# EAGLE design mini-store-selector (EAGLE 7.6.0)

## Sheet 1 of 4
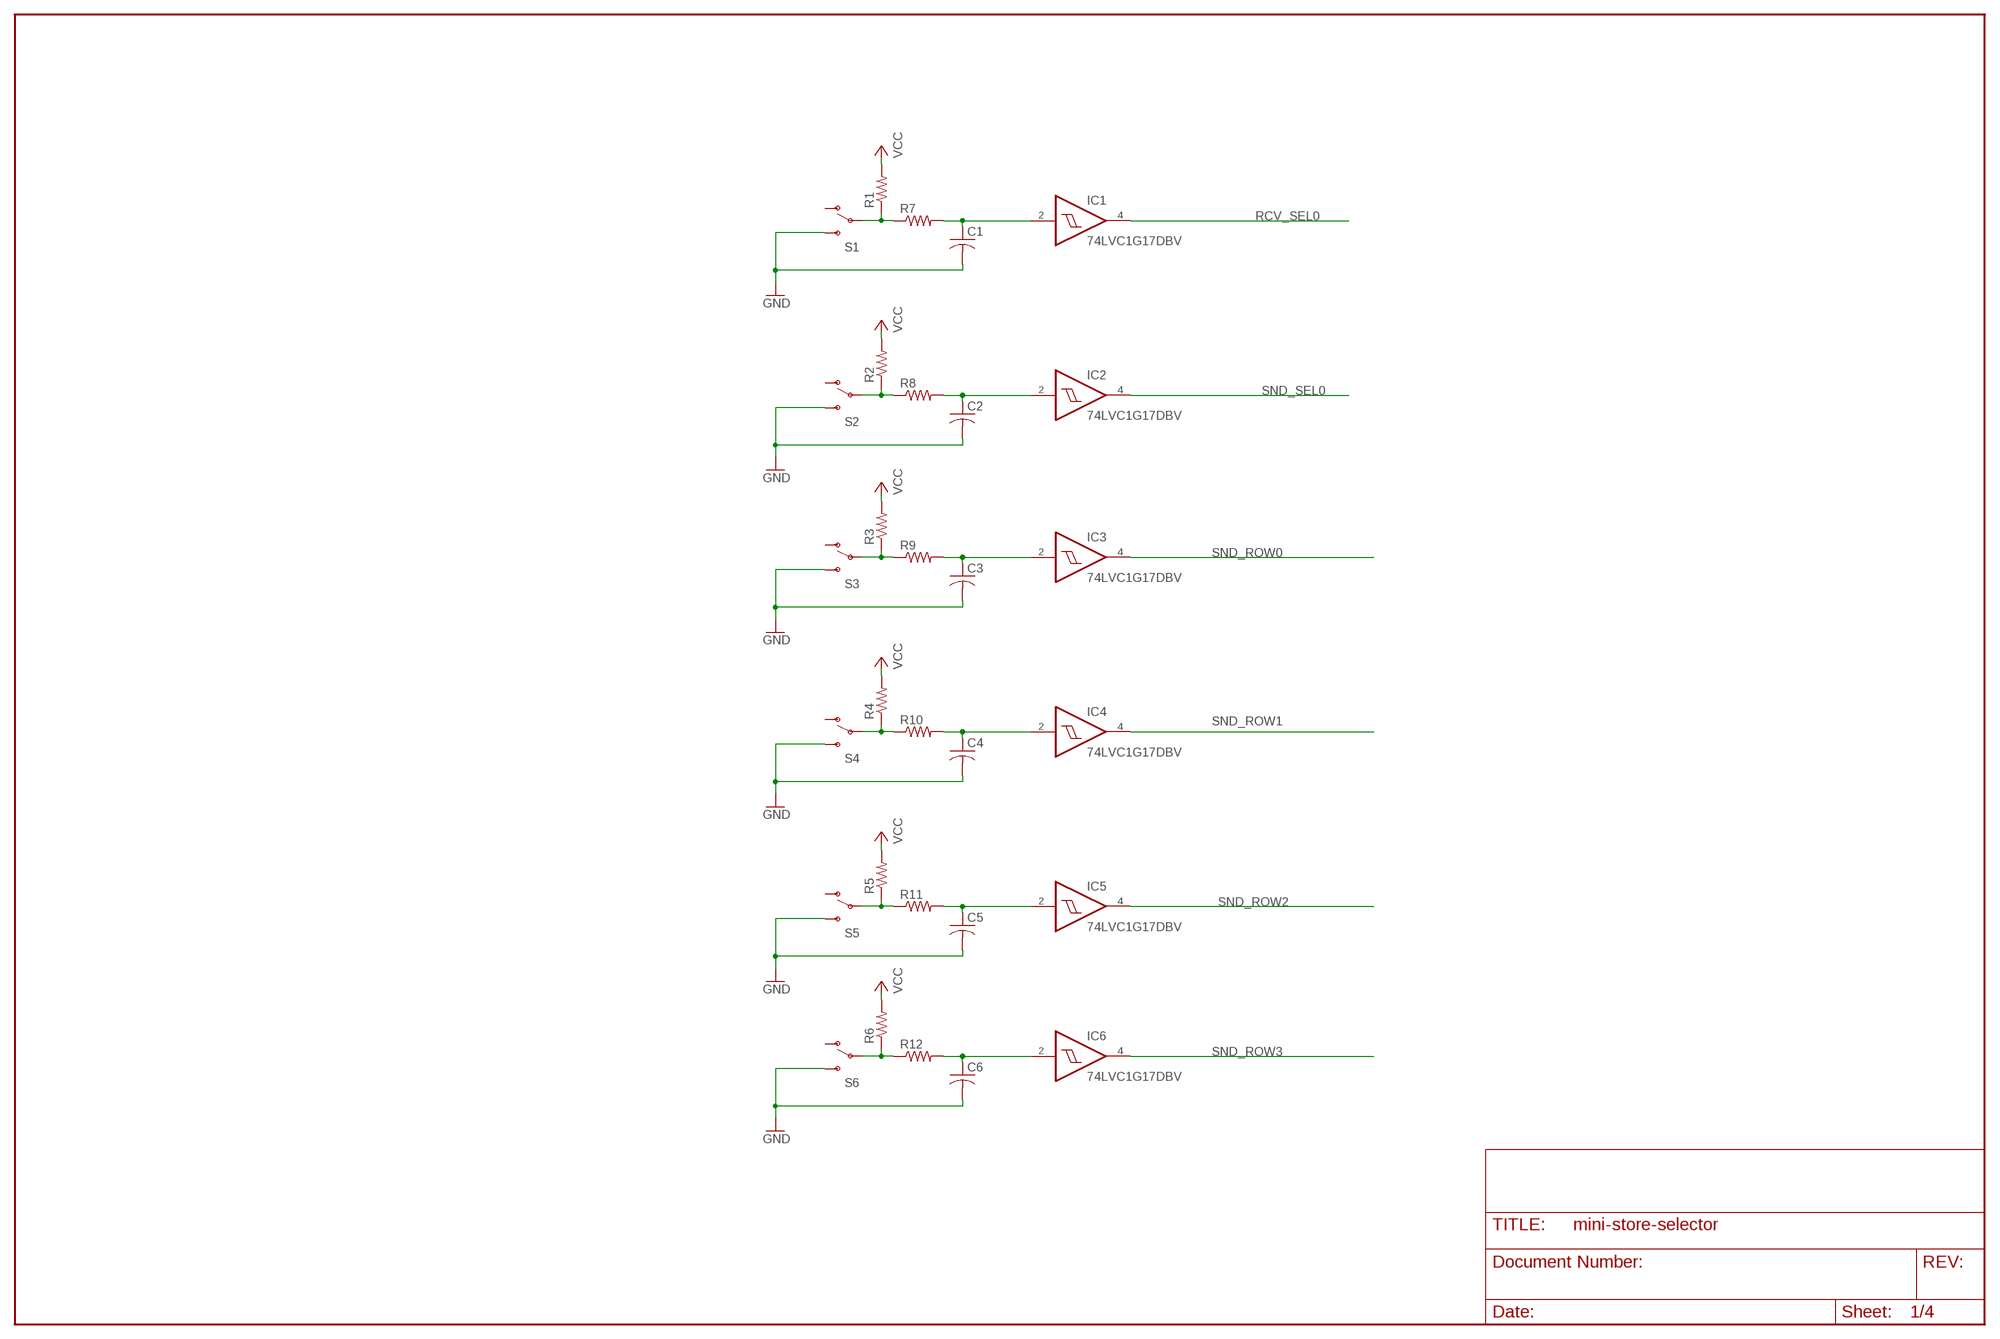
[diagram p0: schematic, sheet 1]

### Parts
C1  C-USC0805  [C0805]
C2  C-USC0805  [C0805]
C3  C-USC0805  [C0805]
C4  C-USC0805  [C0805]
C5  C-USC0805  [C0805]
C6  C-USC0805  [C0805]
IC1  74LVC1G17DBV  [SOT23-5]
IC2  74LVC1G17DBV  [SOT23-5]
IC3  74LVC1G17DBV  [SOT23-5]
IC4  74LVC1G17DBV  [SOT23-5]
IC5  74LVC1G17DBV  [SOT23-5]
IC6  74LVC1G17DBV  [SOT23-5]
R1  R-US_R0805  [R0805]
R2  R-US_R0805  [R0805]
R3  R-US_R0805  [R0805]
R4  R-US_R0805  [R0805]
R5  R-US_R0805  [R0805]
R6  R-US_R0805  [R0805]
R7  R-US_R0805  [R0805]
R8  R-US_R0805  [R0805]
R9  R-US_R0805  [R0805]
R10  R-US_R0805  [R0805]
R11  R-US_R0805  [R0805]
R12  R-US_R0805  [R0805]
S1  SWITCH-SPDTPTH  [SWITCH-SPDT]
S2  SWITCH-SPDTPTH  [SWITCH-SPDT]
S3  SWITCH-SPDTPTH  [SWITCH-SPDT]
S4  SWITCH-SPDTPTH  [SWITCH-SPDT]
S5  SWITCH-SPDTPTH  [SWITCH-SPDT]
S6  SWITCH-SPDTPTH  [SWITCH-SPDT]

### Nets
GND: C1.2 C2.2 C3.2 C4.2 C5.2 C6.2 S1.3(S) S2.3(S) S3.3(S) S4.3(S) S5.3(S) S6.3(S) ; also sheet 2,3,4
N$1: C6.1 IC6.2(I) R12.2
N$2: R6.1 R12.1 S6.2(P)
N$11: C2.1 IC2.2(I) R8.2
N$12: R2.1 R8.1 S2.2(P)
N$13: C1.1 IC1.2(I) R7.2
N$14: C4.1 IC4.2(I) R10.2
N$15: R4.1 R10.1 S4.2(P)
N$16: C3.1 IC3.2(I) R9.2
N$17: R3.1 R9.1 S3.2(P)
N$18: C5.1 IC5.2(I) R11.2
N$19: R5.1 R11.1 S5.2(P)
N$20: R1.1 R7.1 S1.2(P)
RCV_SEL0: IC1.4(O) ; also sheet 4
SND_ROW0: IC3.4(O) ; also sheet 4
SND_ROW1: IC4.4(O) ; also sheet 4
SND_ROW2: IC5.4(O) ; also sheet 4
SND_ROW3: IC6.4(O) ; also sheet 4
SND_SEL0: IC2.4(O) ; also sheet 4
VCC: R1.2 R2.2 R3.2 R4.2 R5.2 R6.2 ; also sheet 2,3,4
Unconnected: S1.1(O) S2.1(O) S3.1(O) S4.1(O) S5.1(O) S6.1(O)

## Sheet 2 of 4
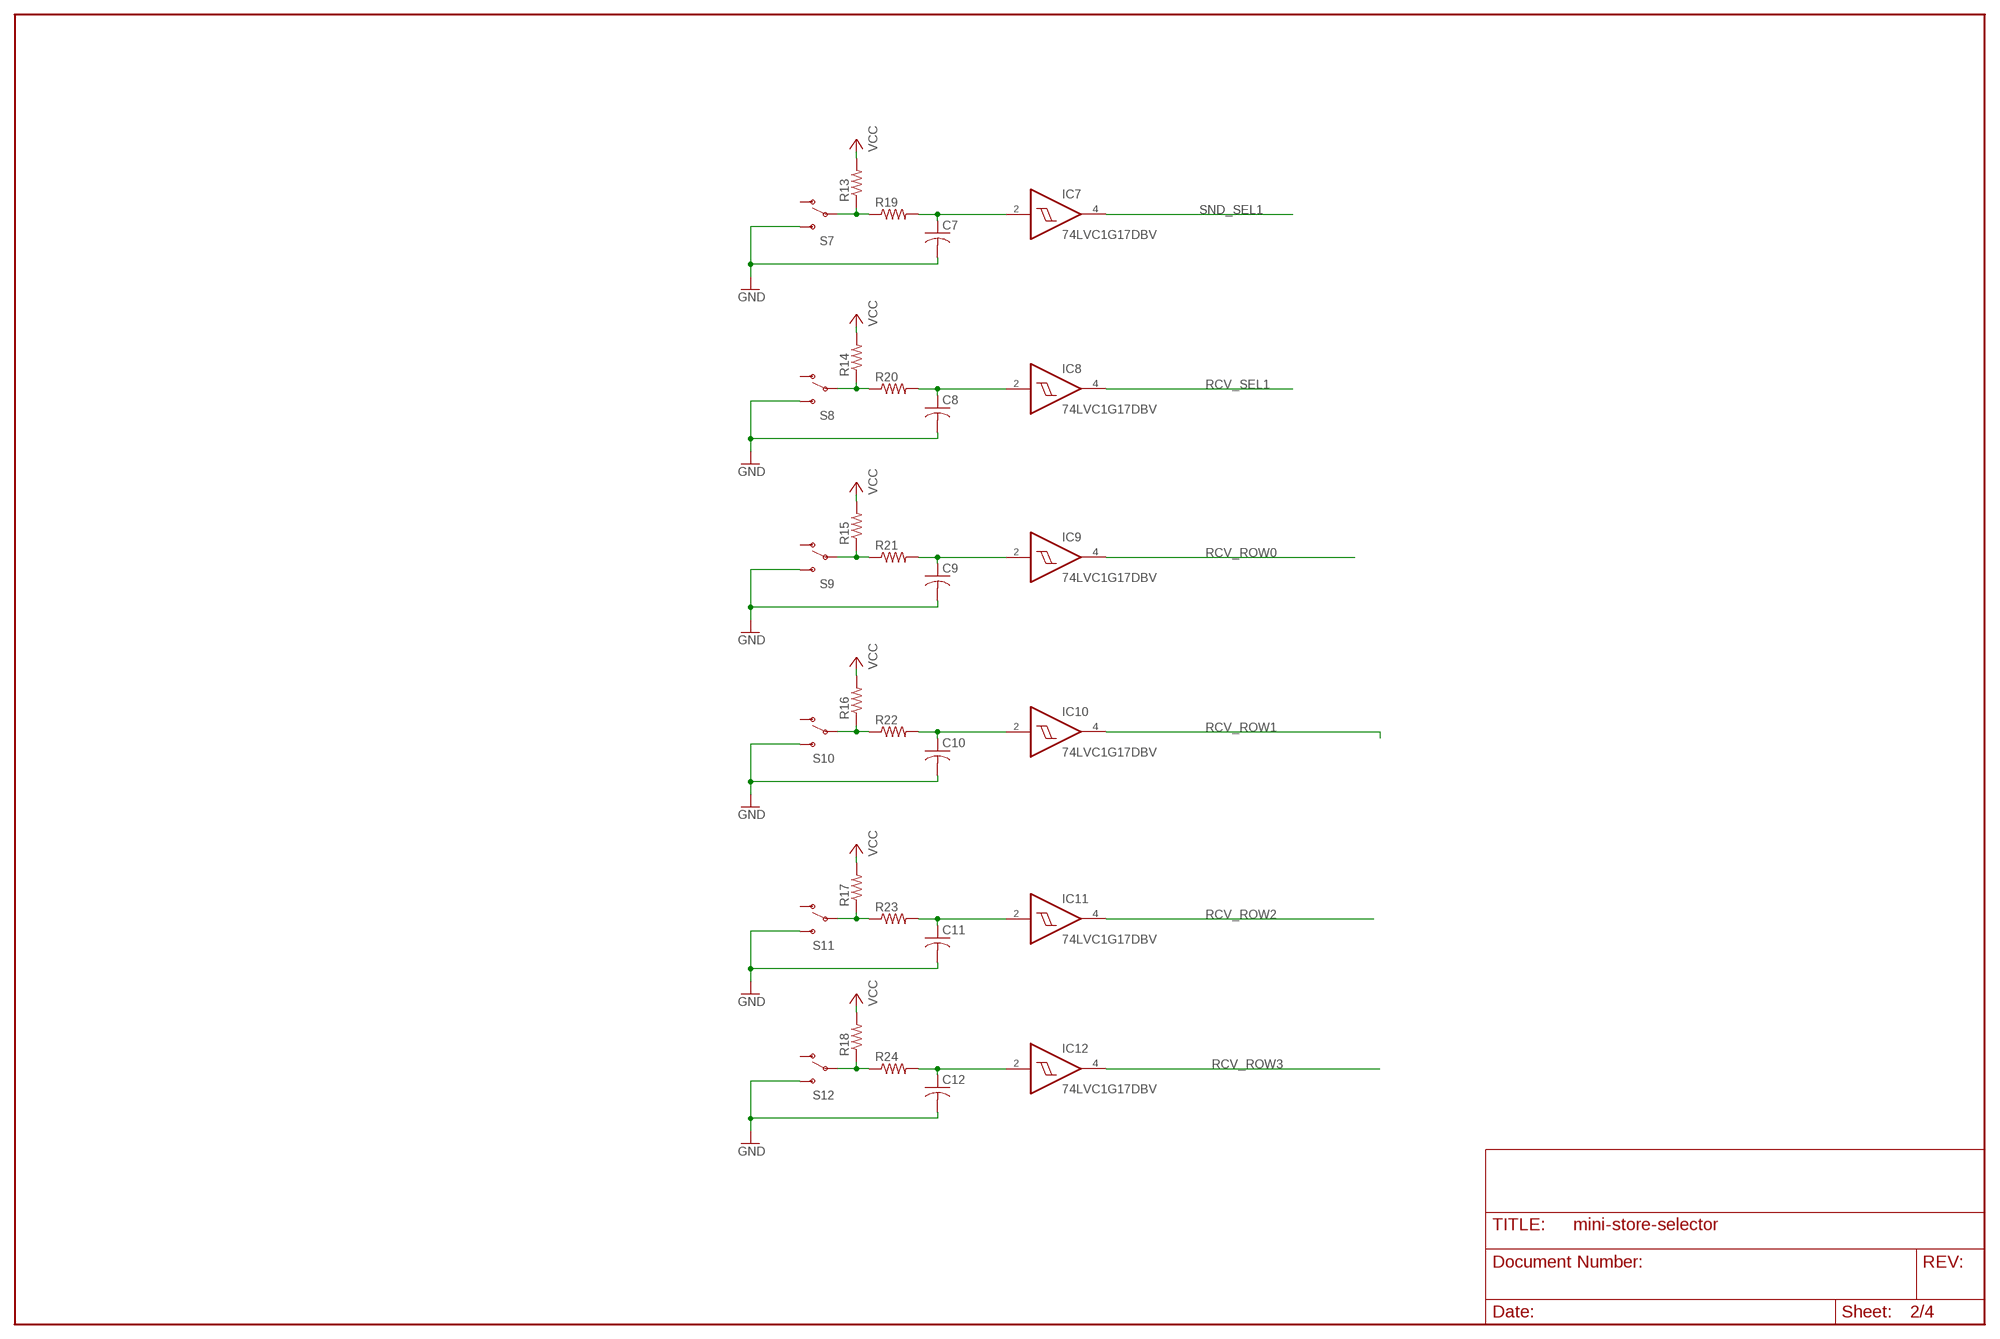
[diagram p1: schematic, sheet 2]

### Parts
C7  C-USC0805  [C0805]
C8  C-USC0805  [C0805]
C9  C-USC0805  [C0805]
C10  C-USC0805  [C0805]
C11  C-USC0805  [C0805]
C12  C-USC0805  [C0805]
IC7  74LVC1G17DBV  [SOT23-5]
IC8  74LVC1G17DBV  [SOT23-5]
IC9  74LVC1G17DBV  [SOT23-5]
IC10  74LVC1G17DBV  [SOT23-5]
IC11  74LVC1G17DBV  [SOT23-5]
IC12  74LVC1G17DBV  [SOT23-5]
R13  R-US_R0805  [R0805]
R14  R-US_R0805  [R0805]
R15  R-US_R0805  [R0805]
R16  R-US_R0805  [R0805]
R17  R-US_R0805  [R0805]
R18  R-US_R0805  [R0805]
R19  R-US_R0805  [R0805]
R20  R-US_R0805  [R0805]
R21  R-US_R0805  [R0805]
R22  R-US_R0805  [R0805]
R23  R-US_R0805  [R0805]
R24  R-US_R0805  [R0805]
S7  SWITCH-SPDTPTH  [SWITCH-SPDT]
S8  SWITCH-SPDTPTH  [SWITCH-SPDT]
S9  SWITCH-SPDTPTH  [SWITCH-SPDT]
S10  SWITCH-SPDTPTH  [SWITCH-SPDT]
S11  SWITCH-SPDTPTH  [SWITCH-SPDT]
S12  SWITCH-SPDTPTH  [SWITCH-SPDT]

### Nets
GND: C7.2 C8.2 C9.2 C10.2 C11.2 C12.2 S7.3(S) S8.3(S) S9.3(S) S10.3(S) S11.3(S) S12.3(S) ; also sheet 1,3,4
N$3: C10.1 IC10.2(I) R22.2
N$4: R16.1 R22.1 S10.2(P)
N$5: C9.1 IC9.2(I) R21.2
N$6: R15.1 R21.1 S9.2(P)
N$7: C11.1 IC11.2(I) R23.2
N$8: R17.1 R23.1 S11.2(P)
N$9: C12.1 IC12.2(I) R24.2
N$10: R18.1 R24.1 S12.2(P)
N$25: C8.1 IC8.2(I) R20.2
N$26: R14.1 R20.1 S8.2(P)
N$27: C7.1 IC7.2(I) R19.2
N$28: R13.1 R19.1 S7.2(P)
RCV_ROW0: IC9.4(O) ; also sheet 4
RCV_ROW1: IC10.4(O) ; also sheet 4
RCV_ROW2: IC11.4(O) ; also sheet 4
RCV_ROW3: IC12.4(O) ; also sheet 4
RCV_SEL1: IC8.4(O) ; also sheet 4
SND_SEL1: IC7.4(O) ; also sheet 4
VCC: R13.2 R14.2 R15.2 R16.2 R17.2 R18.2 ; also sheet 1,3,4
Unconnected: S7.1(O) S8.1(O) S9.1(O) S10.1(O) S11.1(O) S12.1(O)

## Sheet 3 of 4
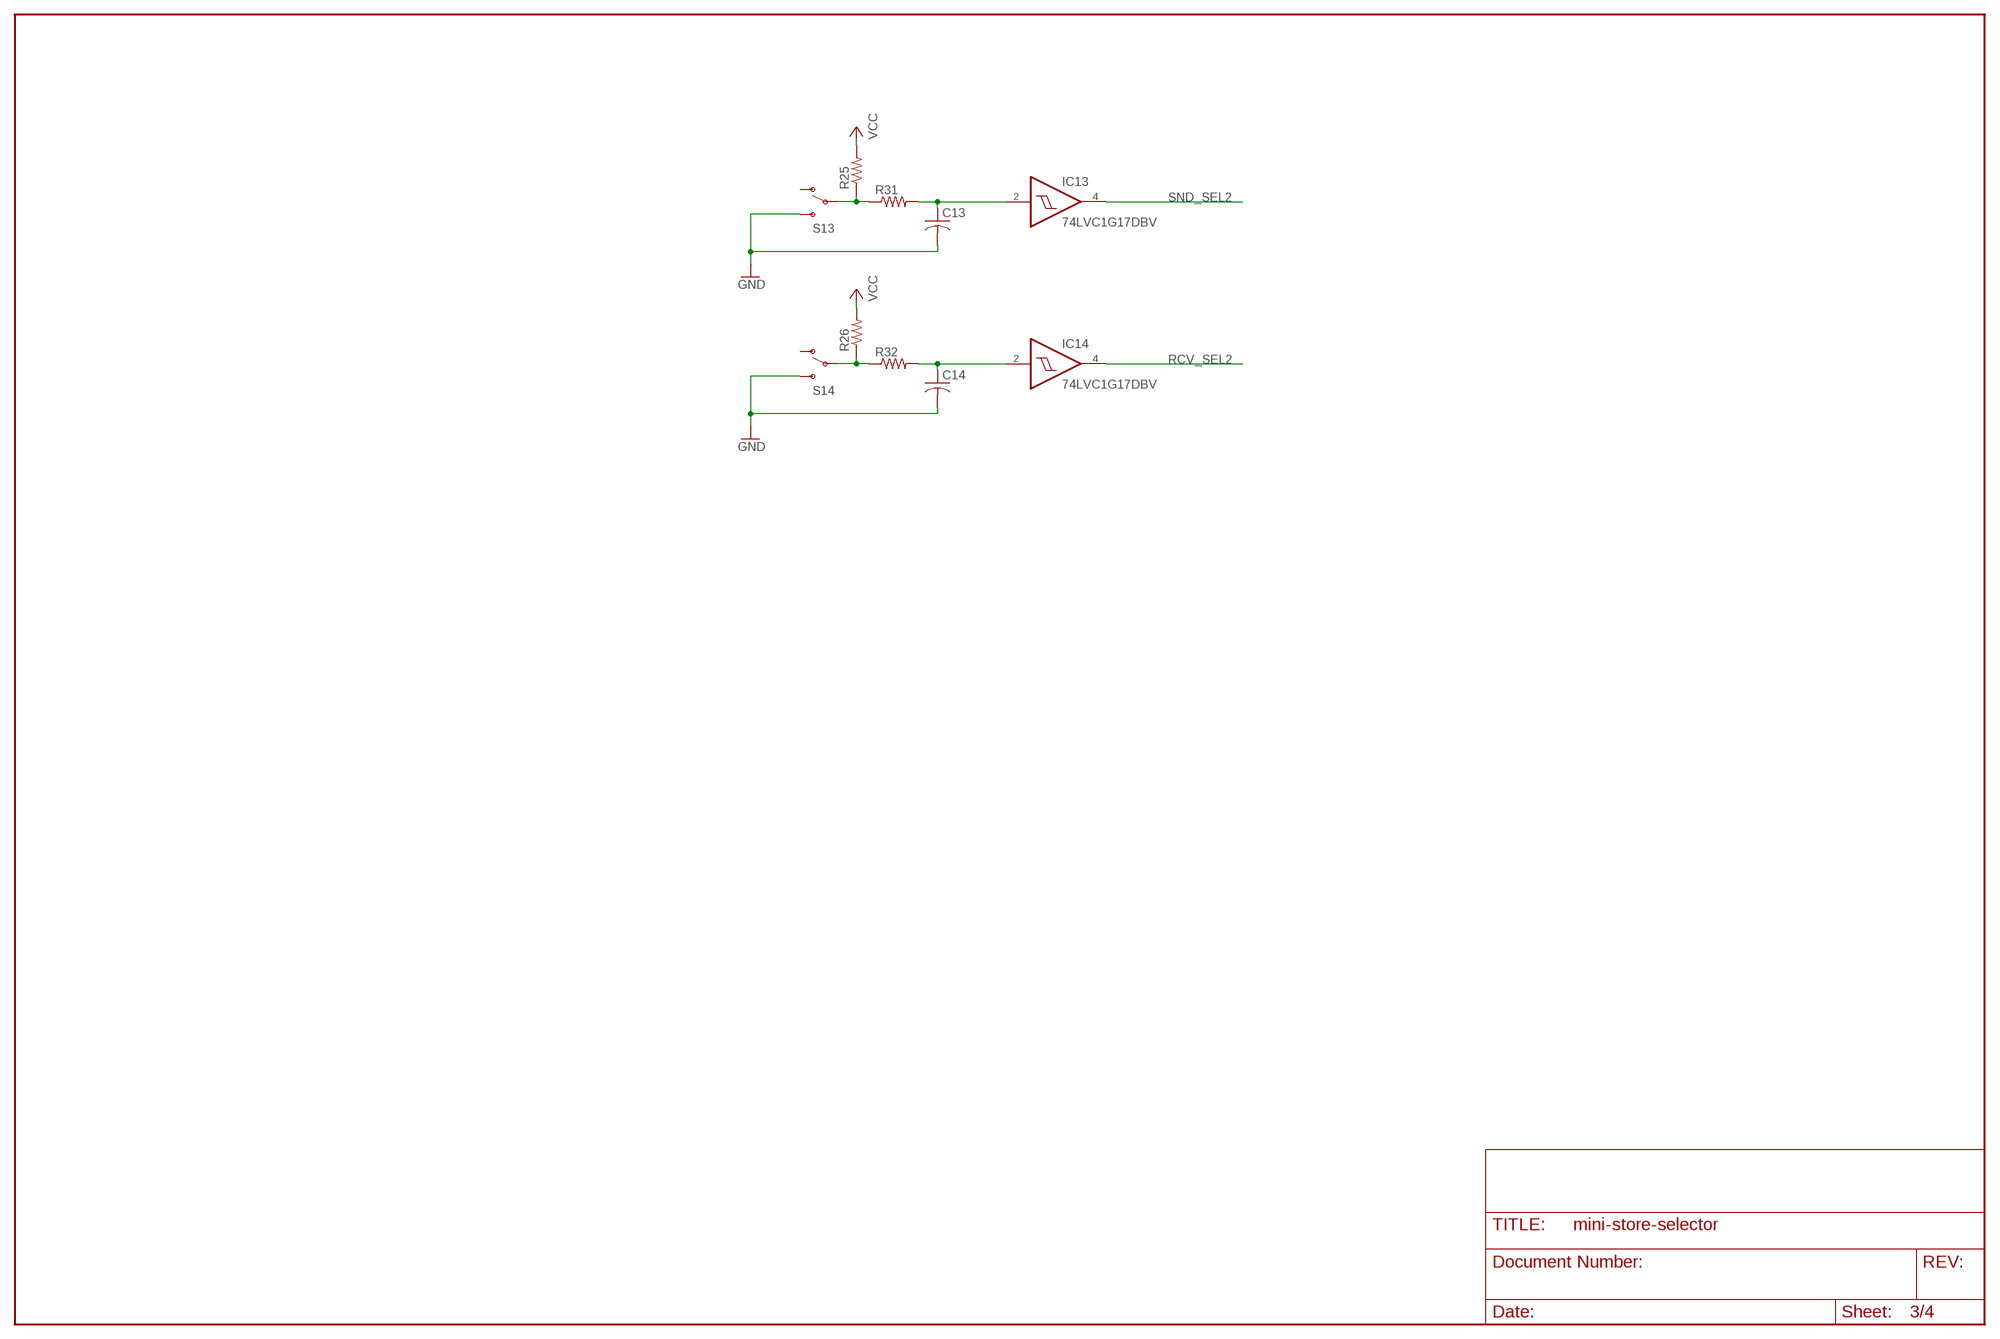
[diagram p2: schematic, sheet 3]

### Parts
C13  C-USC0805  [C0805]
C14  C-USC0805  [C0805]
IC13  74LVC1G17DBV  [SOT23-5]
IC14  74LVC1G17DBV  [SOT23-5]
R25  R-US_R0805  [R0805]
R26  R-US_R0805  [R0805]
R31  R-US_R0805  [R0805]
R32  R-US_R0805  [R0805]
S13  SWITCH-SPDTPTH  [SWITCH-SPDT]
S14  SWITCH-SPDTPTH  [SWITCH-SPDT]

### Nets
GND: C13.2 C14.2 S13.3(S) S14.3(S) ; also sheet 1,2,4
N$51: C14.1 IC14.2(I) R32.2
N$52: R26.1 R32.1 S14.2(P)
N$53: C13.1 IC13.2(I) R31.2
N$54: R25.1 R31.1 S13.2(P)
RCV_SEL2: IC14.4(O) ; also sheet 4
SND_SEL2: IC13.4(O) ; also sheet 4
VCC: R25.2 R26.2 ; also sheet 1,2,4
Unconnected: S13.1(O) S14.1(O)

## Sheet 4 of 4
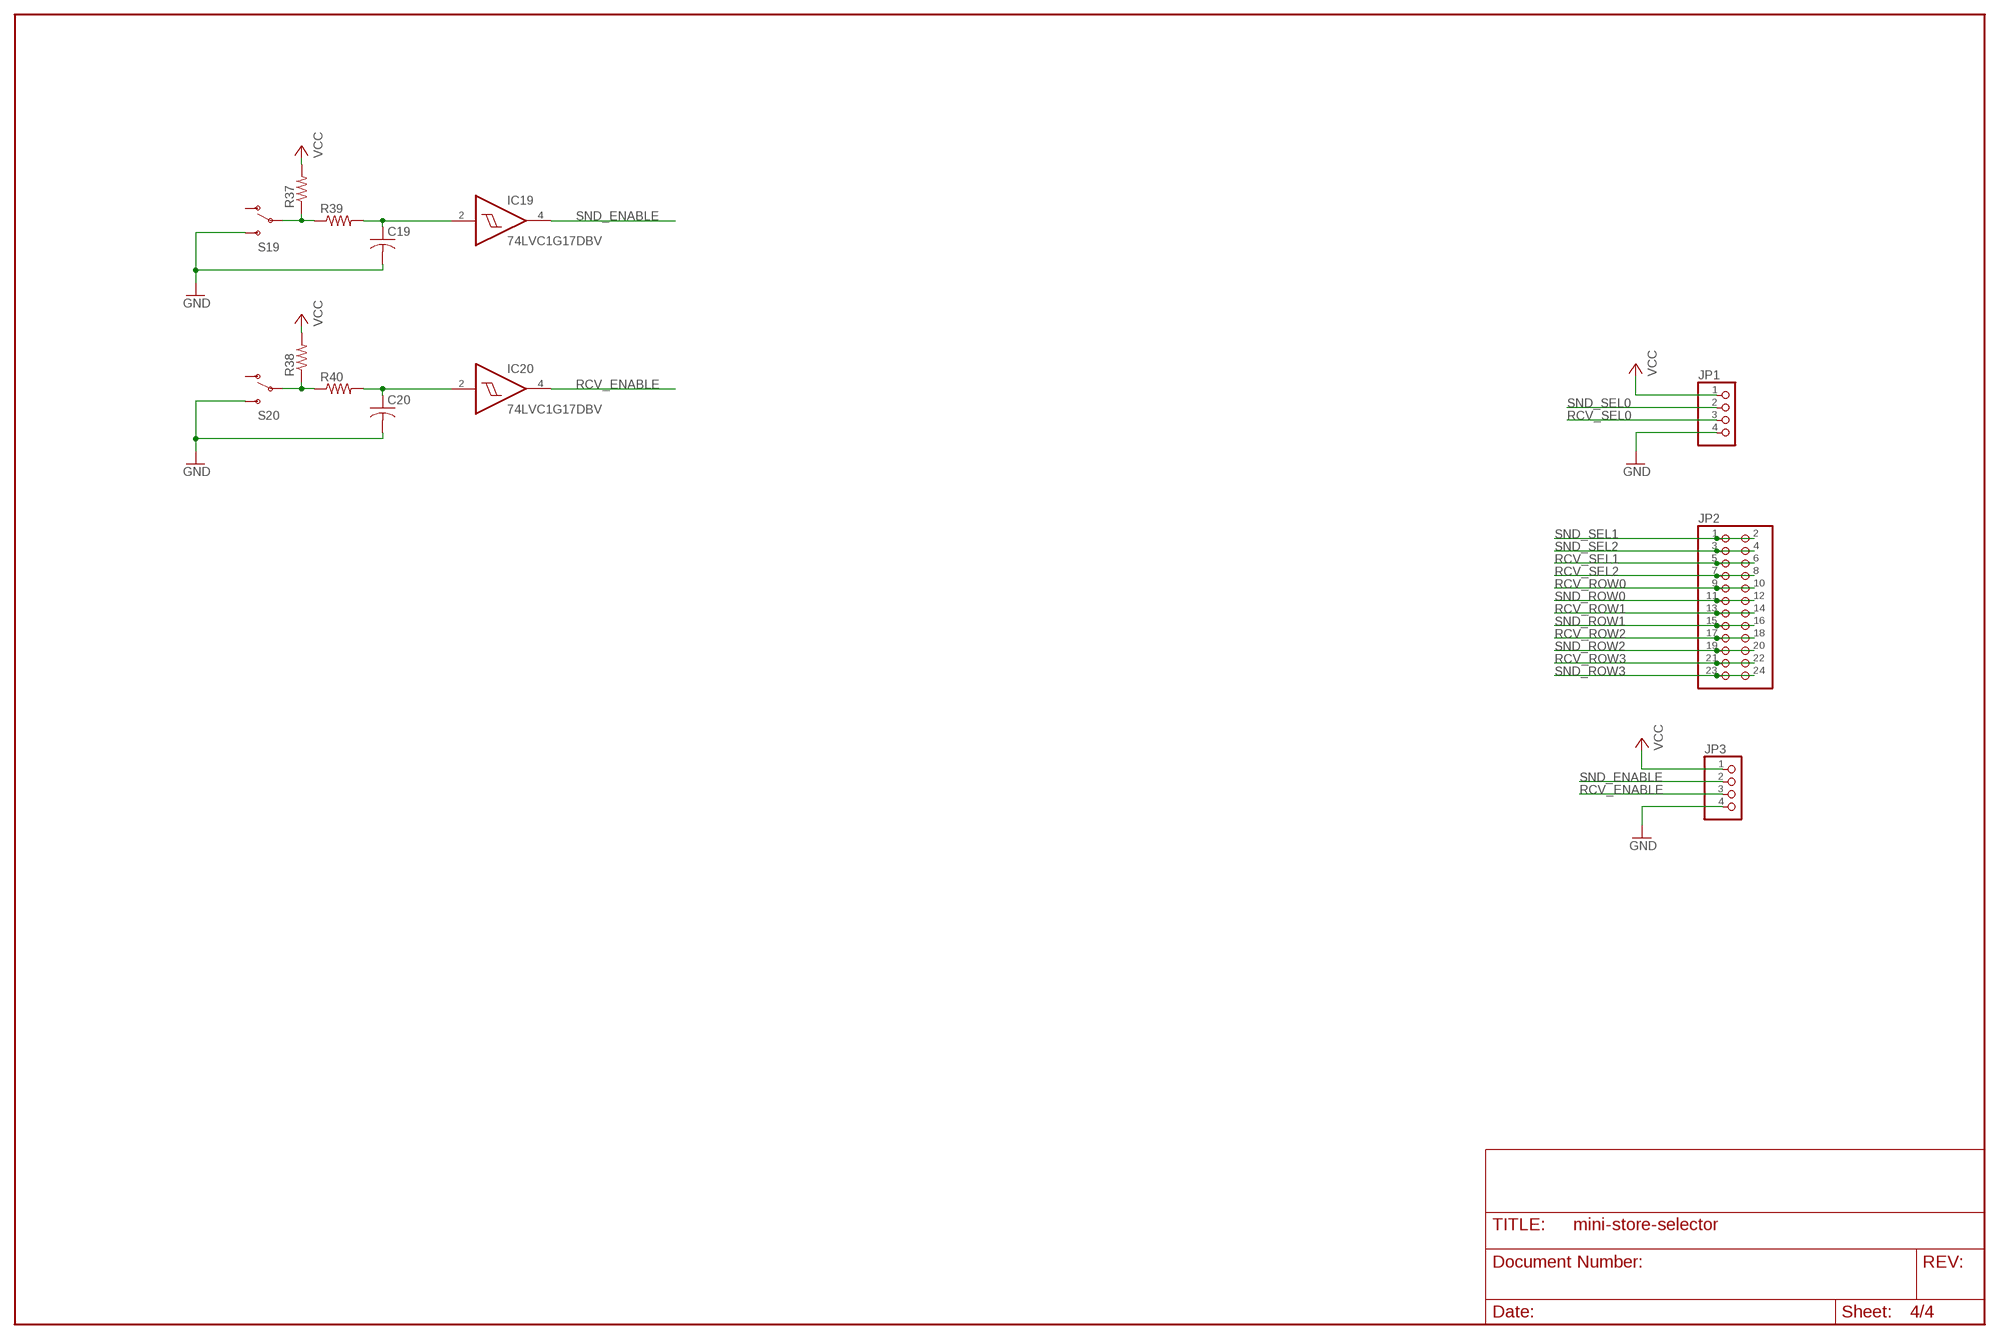
[diagram p3: schematic, sheet 4]

### Parts
C19  C-USC0805  [C0805]
C20  C-USC0805  [C0805]
IC19  74LVC1G17DBV  [SOT23-5]
IC20  74LVC1G17DBV  [SOT23-5]
JP1  PINHD-1X4  [1X04]
JP2  PINHD-2X12  [2X12]
JP3  PINHD-1X4  [1X04]
R37  R-US_R0805  [R0805]
R38  R-US_R0805  [R0805]
R39  R-US_R0805  [R0805]
R40  R-US_R0805  [R0805]
S19  SWITCH-SPDTPTH  [SWITCH-SPDT]
S20  SWITCH-SPDTPTH  [SWITCH-SPDT]

### Nets
GND: C19.2 C20.2 JP1.4 JP3.4 S19.3(S) S20.3(S) ; also sheet 1,2,3
N$21: C20.1 IC20.2(I) R40.2
N$22: R38.1 R40.1 S20.2(P)
N$29: C19.1 IC19.2(I) R39.2
N$30: R37.1 R39.1 S19.2(P)
RCV_ENABLE: IC20.4(O) JP3.3
RCV_ROW0: JP2.9 JP2.10 ; also sheet 2
RCV_ROW1: JP2.13 JP2.14 ; also sheet 2
RCV_ROW2: JP2.17 JP2.18 ; also sheet 2
RCV_ROW3: JP2.21 JP2.22 ; also sheet 2
RCV_SEL0: JP1.3 ; also sheet 1
RCV_SEL1: JP2.5 JP2.6 ; also sheet 2
RCV_SEL2: JP2.7 JP2.8 ; also sheet 3
SND_ENABLE: IC19.4(O) JP3.2
SND_ROW0: JP2.11 JP2.12 ; also sheet 1
SND_ROW1: JP2.15 JP2.16 ; also sheet 1
SND_ROW2: JP2.19 JP2.20 ; also sheet 1
SND_ROW3: JP2.23 JP2.24 ; also sheet 1
SND_SEL0: JP1.2 ; also sheet 1
SND_SEL1: JP2.1 JP2.2 ; also sheet 2
SND_SEL2: JP2.3 JP2.4 ; also sheet 3
VCC: JP1.1 JP3.1 R37.2 R38.2 ; also sheet 1,2,3
Unconnected: S19.1(O) S20.1(O)

## Power pins joined to a net without a drawn wire
GND: IC1.3(GND) IC2.3(GND) IC3.3(GND) IC4.3(GND) IC5.3(GND) IC6.3(GND) IC7.3(GND) IC8.3(GND) IC9.3(GND) IC10.3(GND) IC11.3(GND) IC12.3(GND) IC13.3(GND) IC14.3(GND) IC19.3(GND) IC20.3(GND)
VCC: IC1.5(VCC) IC2.5(VCC) IC3.5(VCC) IC4.5(VCC) IC5.5(VCC) IC6.5(VCC) IC7.5(VCC) IC8.5(VCC) IC9.5(VCC) IC10.5(VCC) IC11.5(VCC) IC12.5(VCC) IC13.5(VCC) IC14.5(VCC) IC19.5(VCC) IC20.5(VCC)

## Library data of the parts
C1-C14 C19 C20 = resistor:C-US: CAPACITOR, American symbol
IC1-IC14 IC19 IC20 = 74xx-little-us:74*1G17: Single Schmitt-Trigger Buffer
JP1 JP3 = pinhead:PINHD-1X4: PIN HEADER
JP2 = pinhead:PINHD-2X12: PIN HEADER
R1-R26 R31 R32 R37-R40 = resistor:R-US_: RESISTOR, American symbol
S1-S14 S19 S20 = SparkFun-Electromechanical:SWITCH-SPDT: SPDT Switch Simple slide switch, Spark Fun Electronics SKU : COM-00102 DPDT SMT slide switch, AYZ0202, SWCH-08179

## Board
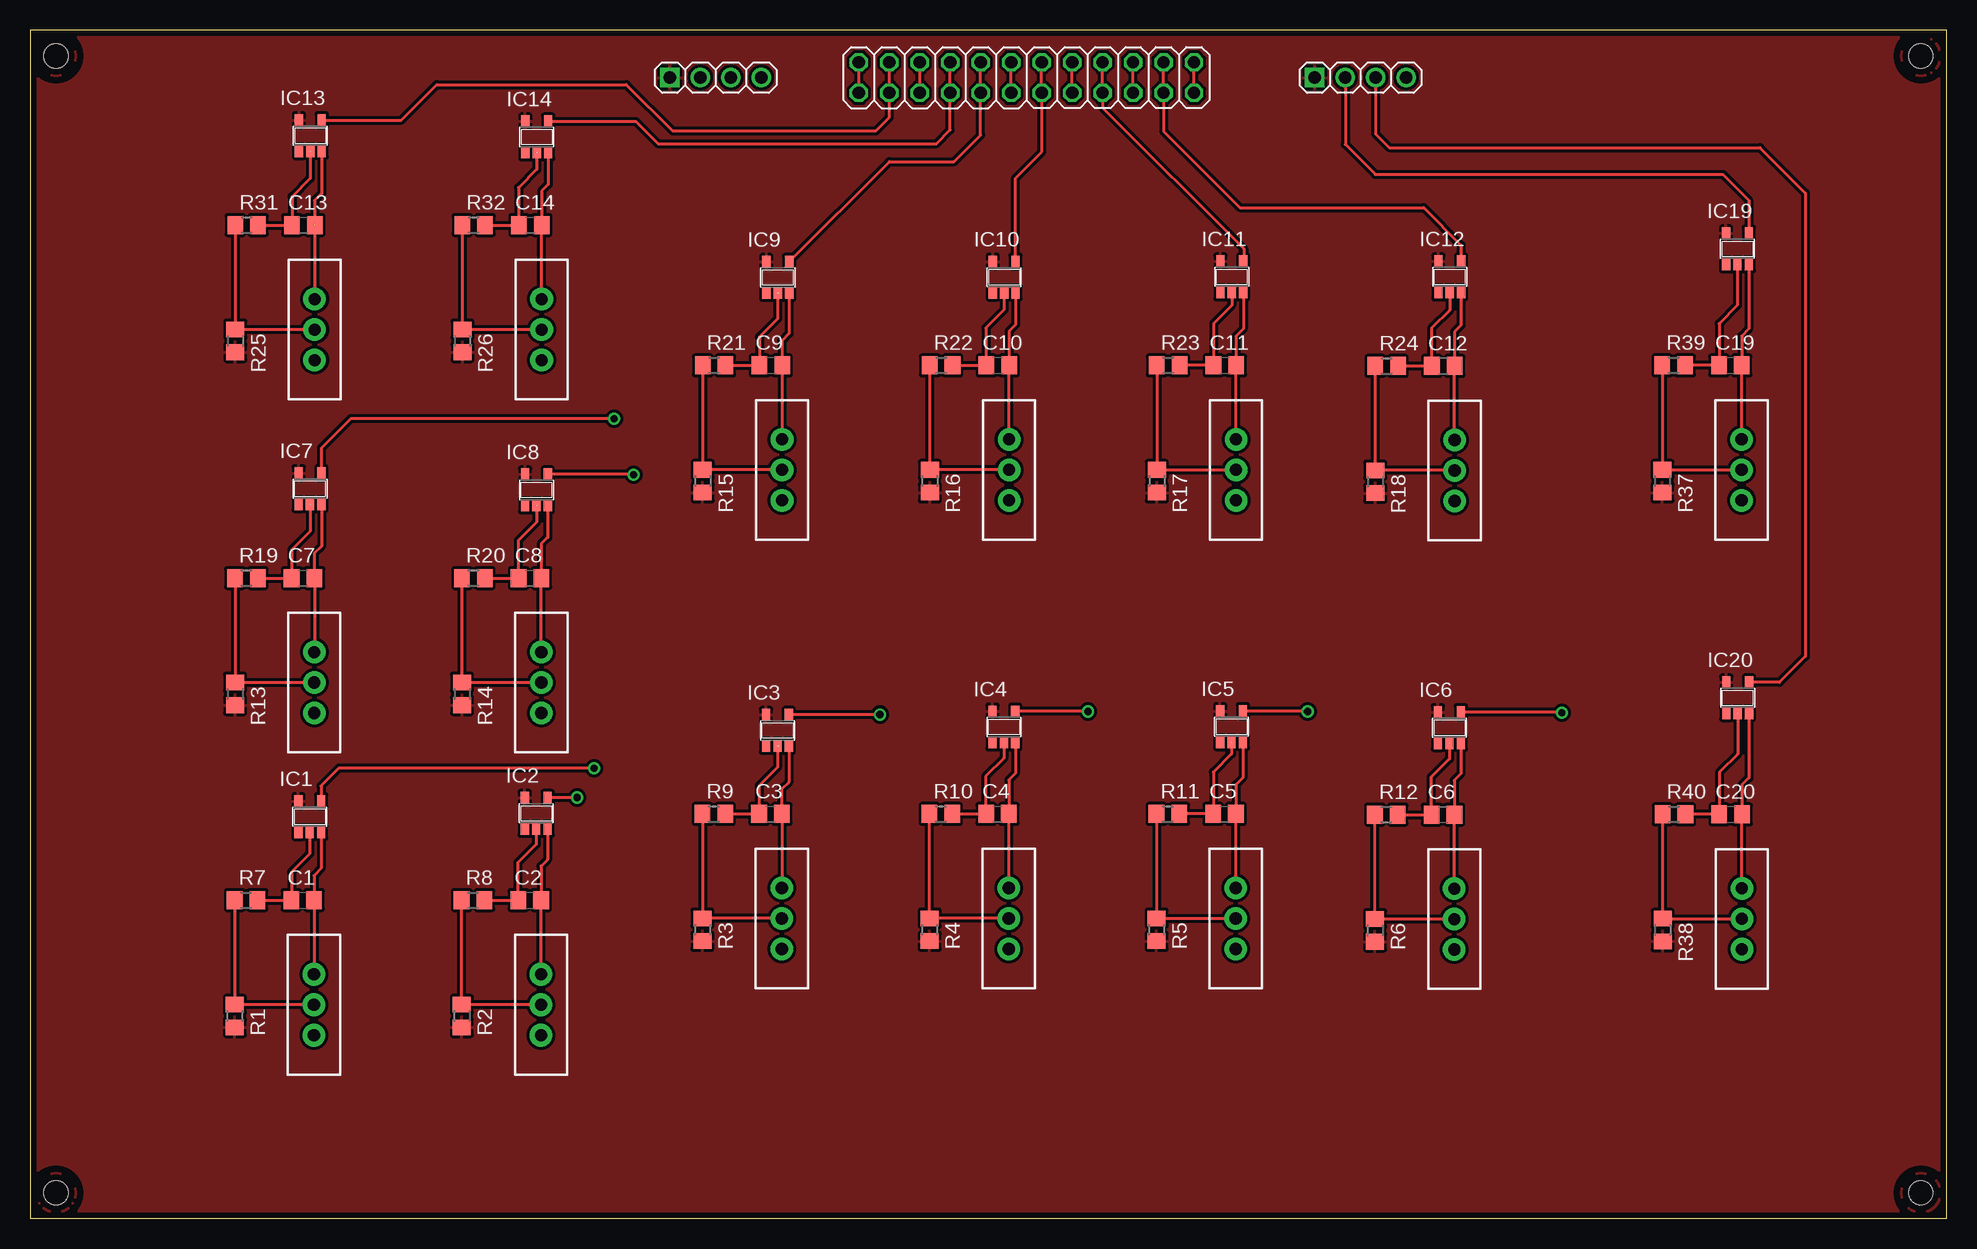
[diagram p4: board, top side]
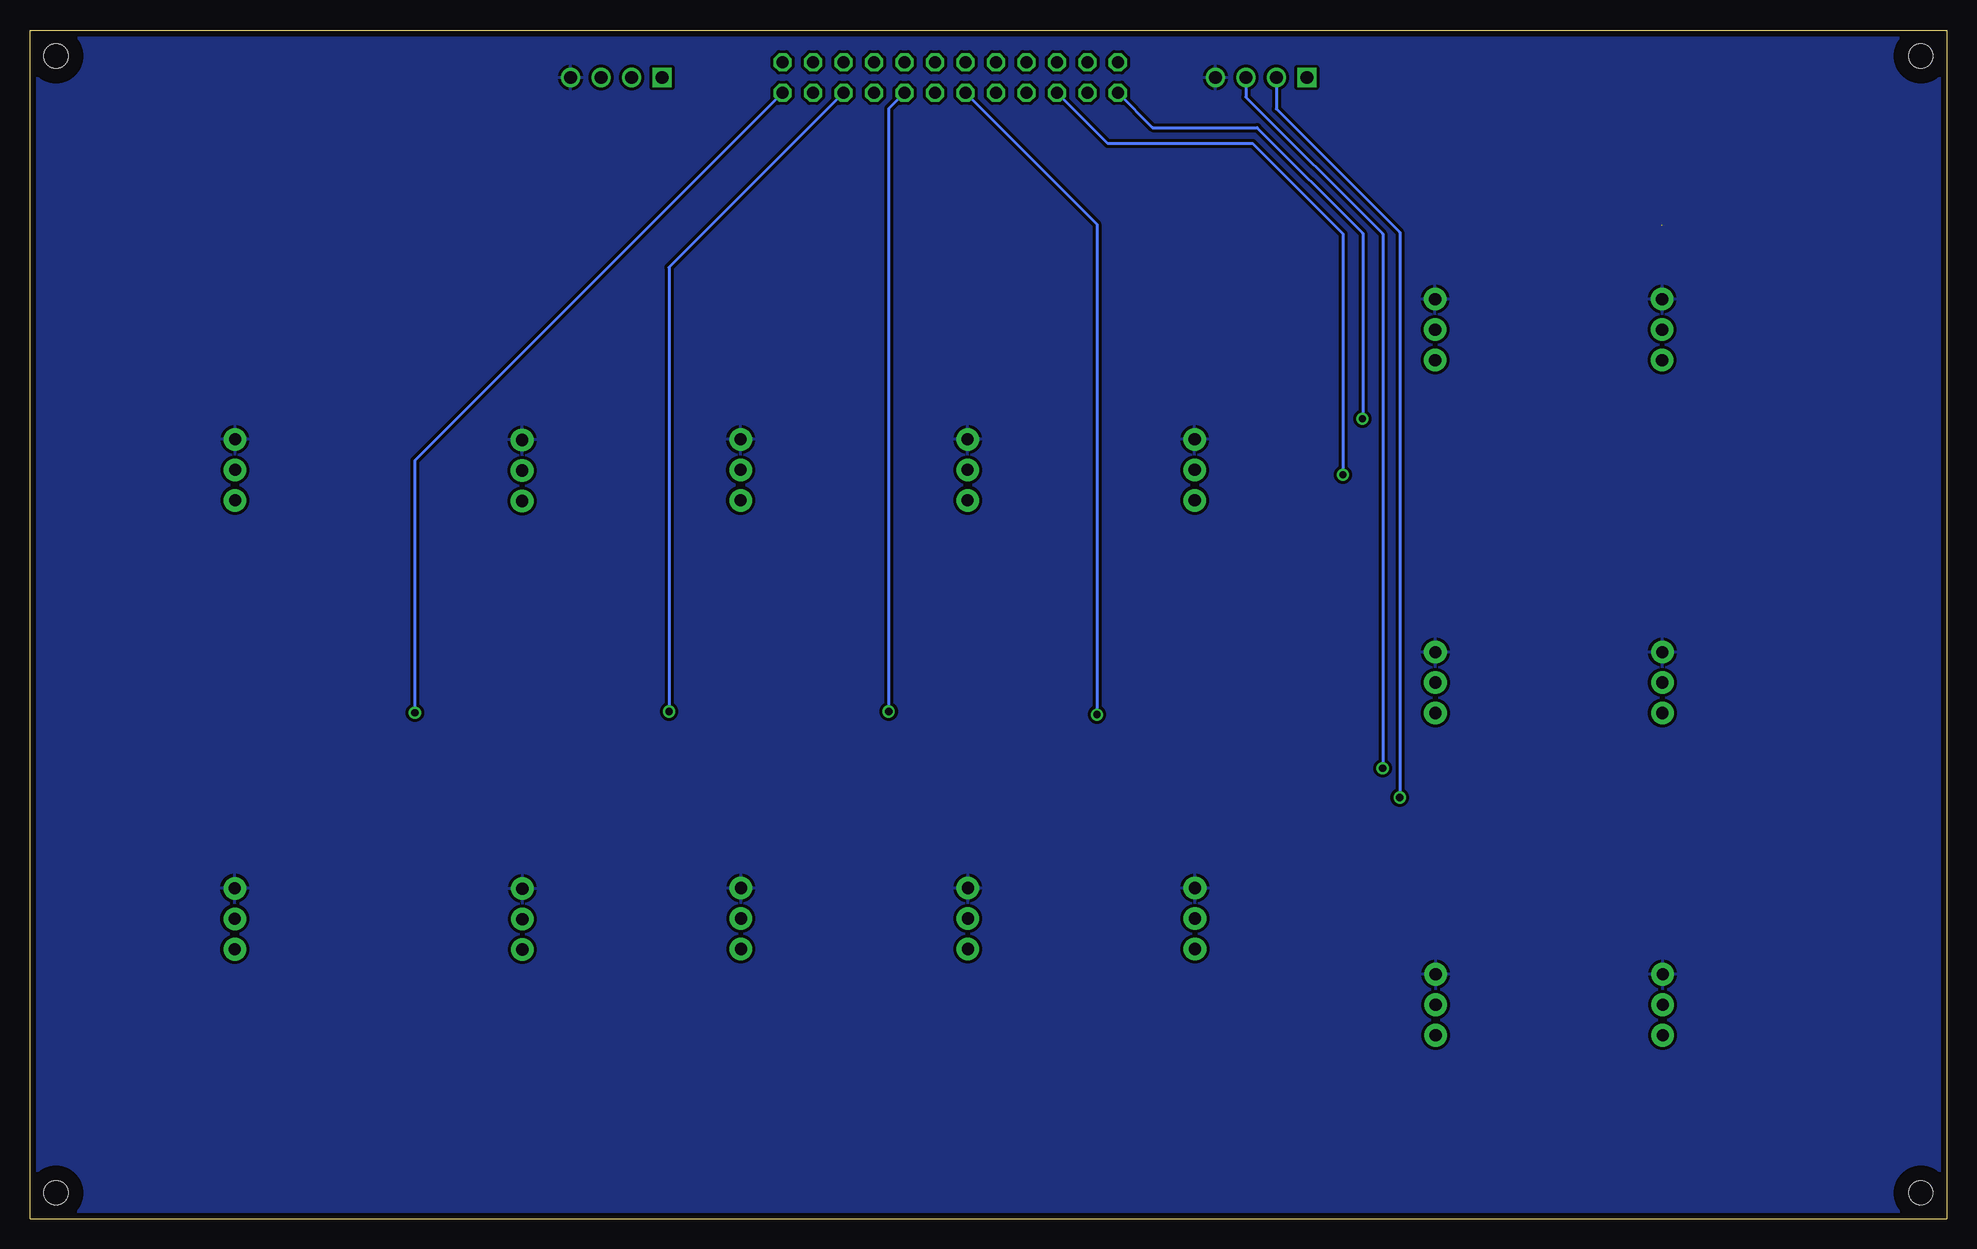
[diagram p5: board, bottom side, seen from below]

Size 159.77 x 99.06 mm. Coordinates in mm from the lower left corner, seen from the top.
Outline: 159.77,99.06 0,99.06 0,0 159.77,0 159.77,99.06
Copper layers (1*16): Top 0.035mm / dielectric 1.5mm / Bottom 0.035mm
Design rules "default *": minimum track width 8mil, minimum drill 12mil, track to track 8mil, track to pad 10mil, pad to pad 10mil, via to via 8mil, smd to smd 8mil, copper to edge 20mil, drill to drill 8mil, minimum pad ring 10mil, minimum via ring 8mil, stop-mask expansion 4mil, vias tented up to drill 0mil, thermal gap 10mil
Holes 2.01 mm at 2.16,2.16 157.61,2.16 157.61,96.9 2.16,96.9
tRestrict: area 155.6,0.2 to 159.6,4.2; area 155.6,94.9 to 159.6,98.9; area 0.2,94.9 to 4.2,98.9; area 0.2,0.2 to 4.2,4.2
bRestrict: area 155.6,0.2 to 159.6,4.2; area 155.6,94.9 to 159.6,98.9; area 0.2,94.9 to 4.2,98.9; area 0.2,0.2 to 4.2,4.2

### Footprints (pad centres in the part's own frame; a part is rotated, then mirrored left to right if it is on the bottom)
C0805 = smd 1.3 x 1.5: 1 -0.95,0; 2 0.95,0
SOT23-5 = smd 0.69 x 0.99: 1 -0.95,-1.29; 2 0,-1.29; 3 0.95,-1.29; 4 0.95,1.3; 5 -0.95,1.3
1X04 = drill 1.067 square: 1 -3.81,0 | drill 1.067: 2 -1.27,0; 3 1.27,0; 4 3.81,0
2X12 = drill 1.016 octagon: 1 -13.97,-1.27; 2 -13.97,1.27; 3 -11.43,-1.27; 4 -11.43,1.27; 5 -8.89,-1.27; 6 -8.89,1.27; 7 -6.35,-1.27; 8 -6.35,1.27; 9 -3.81,-1.27; 10 -3.81,1.27; 11 -1.27,-1.27; 12 -1.27,1.27; 13 1.27,-1.27; 14 1.27,1.27; 15 3.81,-1.27; 16 3.81,1.27; 17 6.35,-1.27; 18 6.35,1.27; 19 8.89,-1.27; 20 8.89,1.27; 21 11.43,-1.27; 22 11.43,1.27; 23 13.97,-1.27; 24 13.97,1.27
R0805 = smd 1.3 x 1.5: 1 -0.95,0; 2 0.95,0
SWITCH-SPDT = drill 1.016 pad 1.88: 1 0,2.54; 2 0,0; 3 0,-2.54

### Placement (x,y rotation side)
C1  22.73,26.54 0 top
C2  41.66,26.54 0 top
C3  61.72,33.73 0 top
C4  80.64,33.73 0 top
C5  99.57,33.73 0 top
C6  117.78,33.68 0 top
C7  22.76,53.39 0 top
C8  41.68,53.39 0 top
C9  61.75,71.12 0 top
C10  80.67,71.12 0 top
C11  99.59,71.12 0 top
C12  117.81,71.07 0 top
C13  22.78,82.8 0 top
C14  41.71,82.8 0 top
C19  141.73,71.12 0 top
C20  141.76,33.71 0 top
IC1  23.32,33.5 0 top
IC2  42.19,33.78 0 top
IC3  62.31,40.69 0 top
IC4  81.18,40.97 0 top
IC5  100.15,41 0 top
IC6  118.31,40.92 0 top
IC7  23.34,60.83 0 top
IC8  42.21,60.73 0 top
IC9  62.33,78.44 0 top
IC10  81.2,78.46 0 top
IC11  100.18,78.49 0 top
IC12  118.34,78.49 0 top
IC13  23.37,90.25 0 top
IC14  42.24,90.14 0 top
IC19  142.32,80.82 0 top
IC20  142.34,43.41 0 top
JP1  57.15,95.1 0 top
JP2  83.06,95.1 0 top
JP3  110.9,95.1 0 top
R1  17.07,16.89 270 top
R2  35.99,16.89 270 top
R3  56.06,24.08 270 top
R4  74.98,24.08 270 top
R5  93.9,24.08 270 top
R6  112.12,24.03 270 top
R7  18.01,26.54 0 top
R8  36.93,26.54 0 top
R9  57,33.73 0 top
R10  75.92,33.73 0 top
R11  94.84,33.73 0 top
R12  113.06,33.68 0 top
R13  17.09,43.74 270 top
R14  36.02,43.74 270 top
R15  56.08,61.47 270 top
R16  75.01,61.47 270 top
R17  93.93,61.47 270 top
R18  112.14,61.42 270 top
R19  18.03,53.39 0 top
R20  36.96,53.39 0 top
R21  57.02,71.12 0 top
R22  75.95,71.12 0 top
R23  94.87,71.12 0 top
R24  113.08,71.07 0 top
R25  17.12,73.15 270 top
R26  36.04,73.15 270 top
R31  18.06,82.8 0 top
R32  36.98,82.8 0 top
R37  136.07,61.47 270 top
R38  136.09,24.05 270 top
R39  137.01,71.12 0 top
R40  137.03,33.71 0 top
S1  23.67,17.83 180 top
S2  42.6,17.83 180 top
S3  62.66,25.02 180 top
S4  81.58,25.02 180 top
S5  100.51,25.02 180 top
S6  118.72,24.97 180 top
S7  23.7,44.68 180 top
S8  42.62,44.68 180 top
S9  62.69,62.41 180 top
S10  81.61,62.41 180 top
S11  100.53,62.41 180 top
S12  118.75,62.36 180 top
S13  23.72,74.09 180 top
S14  42.65,74.09 180 top
S19  142.67,62.41 180 top
S20  142.7,24.99 180 top

### Tracks (layer width: path | path; a pad name or v marks a point on that pad's centre or on a via)
GND  (1 unrouted)
  Top 0.254: IC5.3 101.1,36.76 100.51,36.17 100.51,33.74 C5.2 100.51,33.72 S5.3 | S3.3 62.67,27.57 C3.2 62.66,35.79 63.26,36.38 IC3.3 | S4.3 C4.2 81.58,36.58 82.13,37.12 IC4.3 | S6.3 C6.2 118.72,33.69 118.72,36.52 119.26,37.07 IC6.3 | IC11.3 101.13,74.15 100.53,73.56 C11.2 S11.3 | S9.3 C9.2 62.69,71.13 62.69,73.18 63.28,73.77 IC9.3 | S10.3 C10.2 81.61,73.97 82.15,74.51 IC10.3 | S12.3 118.75,71.06 C12.2 118.75,71.08 118.75,73.91 119.29,74.46 IC12.3 | IC20.3 143.29,36.74 142.7,36.14 142.7,33.72 C20.2 142.7,33.7 S20.3 | S1.3 23.68,20.38 C1.2 23.67,26.55 23.67,28.6 24.27,29.2 IC1.3 | S2.3 42.6,26.53 C2.2 42.6,26.55 42.6,29.39 43.14,29.93 IC2.3 | IC19.3 143.27,74.15 142.67,73.56 C19.2 S19.3 | S7.3 C7.2 23.7,53.4 23.7,55.45 24.29,56.04 IC7.3 | S8.3 C8.2 42.62,53.4 42.62,56.24 43.16,56.78 IC8.3 | IC13.3 24.32,85.46 23.72,84.86 23.72,82.81 | S14.3 42.65,82.79 C14.2 42.65,82.81 42.65,85.65 43.19,86.19 IC14.3 | C13.2 23.73,76.64 S13.3
  pour Bottom (isolate 0.254): 159.77,0 0,0 0,99.06 159.77,99.06
N$1
  Top 0.254: R12.2 C6.1 116.79,33.72 116.79,36.8 118.31,38.33 IC6.2
N$2
  Top 0.254: R12.1 R6.1 112.13,24.97 S6.2
N$3
  Top 0.254: R22.2 C10.1 79.68,71.16 79.68,74.24 81.2,75.77 IC10.2
N$4
  Top 0.254: R22.1 R16.1 75.02,62.41 S10.2
N$5
  Top 0.254: R21.2 C9.1 60.81,73.48 62.33,75.01 IC9.2
N$6
  Top 0.254: R21.1 R15.1 56.09,62.41 S9.2
N$7
  Top 0.254: IC11.2 100.18,76.12 98.65,74.6 98.65,71.13 | 98.65,71.13 C11.1 | 98.65,71.13 R23.2
N$8
  Top 0.254: R23.1 93.92,62.43 R17.1 S11.2
N$9
  Top 0.254: R24.2 C12.1 116.81,71.11 116.81,74.19 118.34,75.72 IC12.2
N$10
  Top 0.254: R24.1 112.14,71.06 R18.1 112.15,62.36 S12.2
N$11
  Top 0.254: R8.2 C2.1 40.66,26.58 40.66,29.67 42.19,31.19 IC2.2
N$12
  Top 0.254: R8.1 35.99,26.53 R2.1 36,17.83 S2.2
N$13
  Top 0.254: R7.2 C1.1 21.79,26.55 21.79,28.91 23.32,30.43 IC1.2
N$14
  Top 0.254: R10.2 C4.1 79.65,33.77 79.65,36.85 81.18,38.38 IC4.2
N$15
  Top 0.254: R10.1 R4.1 74.99,25.02 S4.2
N$16
  Top 0.254: R9.2 C3.1 60.78,33.74 60.78,36.09 62.31,37.62 IC3.2
N$17
  Top 0.254: R9.1 56.05,25.04 R3.1 56.07,25.02 S3.2
N$18
  Top 0.254: IC5.2 100.15,38.73 98.63,37.21 C5.1 | C5.1 | C5.1 95.8,33.74 R11.2
N$19
  Top 0.254: R11.1 R5.1 100.5,25.03 S5.2
N$20
  Top 0.254: R7.1 R1.1 S1.2
N$21
  Top 0.254: IC20.2 142.34,38.71 140.82,37.19 C20.1 | C20.1 | C20.1 137.99,33.72 R40.2
N$22
  Top 0.254: R40.1 136.08,25.01 R38.1 142.69,25 S20.2
N$25
  Top 0.254: R20.2 C8.1 40.69,53.43 40.69,56.52 42.22,58.04 IC8.2
N$26
  Top 0.254: R20.1 R14.1 S8.2
N$27
  Top 0.254: R19.2 C7.1 21.82,53.4 21.82,55.75 23.34,57.28 IC7.2
N$28
  Top 0.254: R19.1 R13.1 17.1,44.68 S7.2
N$29
  Top 0.254: IC19.2 142.32,76.12 140.79,74.6 140.79,71.13 | 140.79,71.13 C19.1 | 140.79,71.13 R39.2
N$30
  Top 0.254: R39.1 136.06,62.43 R37.1 S19.2
N$51
  Top 0.254: R32.2 C14.1 40.72,82.84 40.72,85.93 42.24,87.45 IC14.2
N$52
  Top 0.254: R32.1 36.04,82.79 R26.1 36.05,74.09 S14.2
N$53
  Top 0.254: R31.2 C13.1 21.84,82.81 21.84,85.17 23.37,86.69 IC13.2
N$54
  Top 0.254: R31.1 17.11,74.11 R25.1 S13.2
RCV_ENABLE
  Top 0.254: JP3.3 112.17,90.4 113.31,89.26 144.2,89.26 147.98,85.47 147.98,46.86 145.82,44.7 IC20.4
RCV_ROW0
  Top 0.254: IC9.4 71.63,88.09 77.04,88.09 79.25,90.3 JP2.9 JP2.10
RCV_ROW1
  Top 0.254: IC10.4 82.15,86.73 84.35,88.92 84.35,93.8 JP2.13 JP2.14
RCV_ROW2
  Top 0.254: IC11.4 101.17,79.83 101.17,80.82 89.41,92.58 JP2.17 JP2.18
RCV_ROW3
  Top 0.254: IC12.4 119.29,81.14 116.18,84.25 100.86,84.25 94.49,90.63 JP2.21 JP2.22
RCV_SEL0  (via drill 0.6)
  Top 0.254: v47.02,37.54 25.73,37.54 24.26,36.07 24.26,34.81 IC1.4
  Bottom 0.254: JP1.3 58.42,93.47 47.02,82.07 v47.02,37.54
RCV_SEL1  (via drill 0.6)
  Top 0.254: JP2.5 JP2.6 | v50.32,62 50.29,62.03 IC8.4
  Bottom 0.254: JP2.5 69.95,89.61 57.86,89.61 50.32,82.07 v50.32,62
RCV_SEL2
  Top 0.254: IC14.4 50.49,91.44 52.35,89.59 75.56,89.59 76.71,90.73 JP2.7 JP2.8
SND_ENABLE
  Top 0.254: IC19.4 143.26,82.13 143.26,84.89 141.35,86.79 141.15,87 141.12,87.02 112.14,87.02 109.63,89.53 JP3.2
SND_ROW0  (via drill 0.6)
  Top 0.254: v70.84,42.01 70.82,41.99 IC3.4 | JP2.11 JP2.12
  Bottom 0.254: JP2.11 70.84,82.88 v70.84,42.01
SND_ROW1  (via drill 0.6)
  Top 0.254: v88.19,42.27 v88.18,42.27 IC4.4 | JP2.15 JP2.16
  Bottom 0.254: JP2.15 88.19,92.51 v88.19,42.27
SND_ROW2  (via drill 0.6)
  Top 0.254: v106.5,42.27 106.47,42.3 IC5.4 | JP2.19 JP2.20
  Bottom 0.254: JP2.19 106.5,79.27 v106.5,42.27
SND_ROW3  (via drill 0.6)
  Top 0.254: v127.69,42.16 127.63,42.22 IC6.4 | JP2.23 JP2.24
  Bottom 0.254: JP2.23 127.69,63.17 v127.69,42.16
SND_SEL0  (via drill 0.6)
  Top 0.254: v45.59,35.1 45.57,35.08 IC2.4
  Bottom 0.254: JP1.2 55.88,92.48 45.59,82.19 v45.59,35.1
SND_SEL1  (via drill 0.6)
  Top 0.254: JP2.1 JP2.2 | v48.69,66.67 26.75,66.67 24.28,64.21 24.28,62.14 IC7.4
  Bottom 0.254: JP2.1 66.19,90.93 57.48,90.93 48.67,82.12 48.67,66.7 v48.69,66.67
SND_SEL2
  Top 0.254: IC13.4 30.94,91.55 33.91,94.51 49.71,94.51 53.57,90.65 70.51,90.65 71.63,91.77 JP2.3 JP2.4
VCC
  pour Top (isolate 0.254, rank 2): 159.77,0 0,0 0,99.06 159.77,99.06

### Text on the board
Document: Block 0 | SND/RCV | 2 | SND | RCV | 0 | 1 | 2 | 3 | RCV ROW SELECT | RCV ENABLE | 1 | SND | RCV | 0 | 1 | 2 | 3 | 0 | SND ROW SELECT | SND ENABLE | SND | RCV